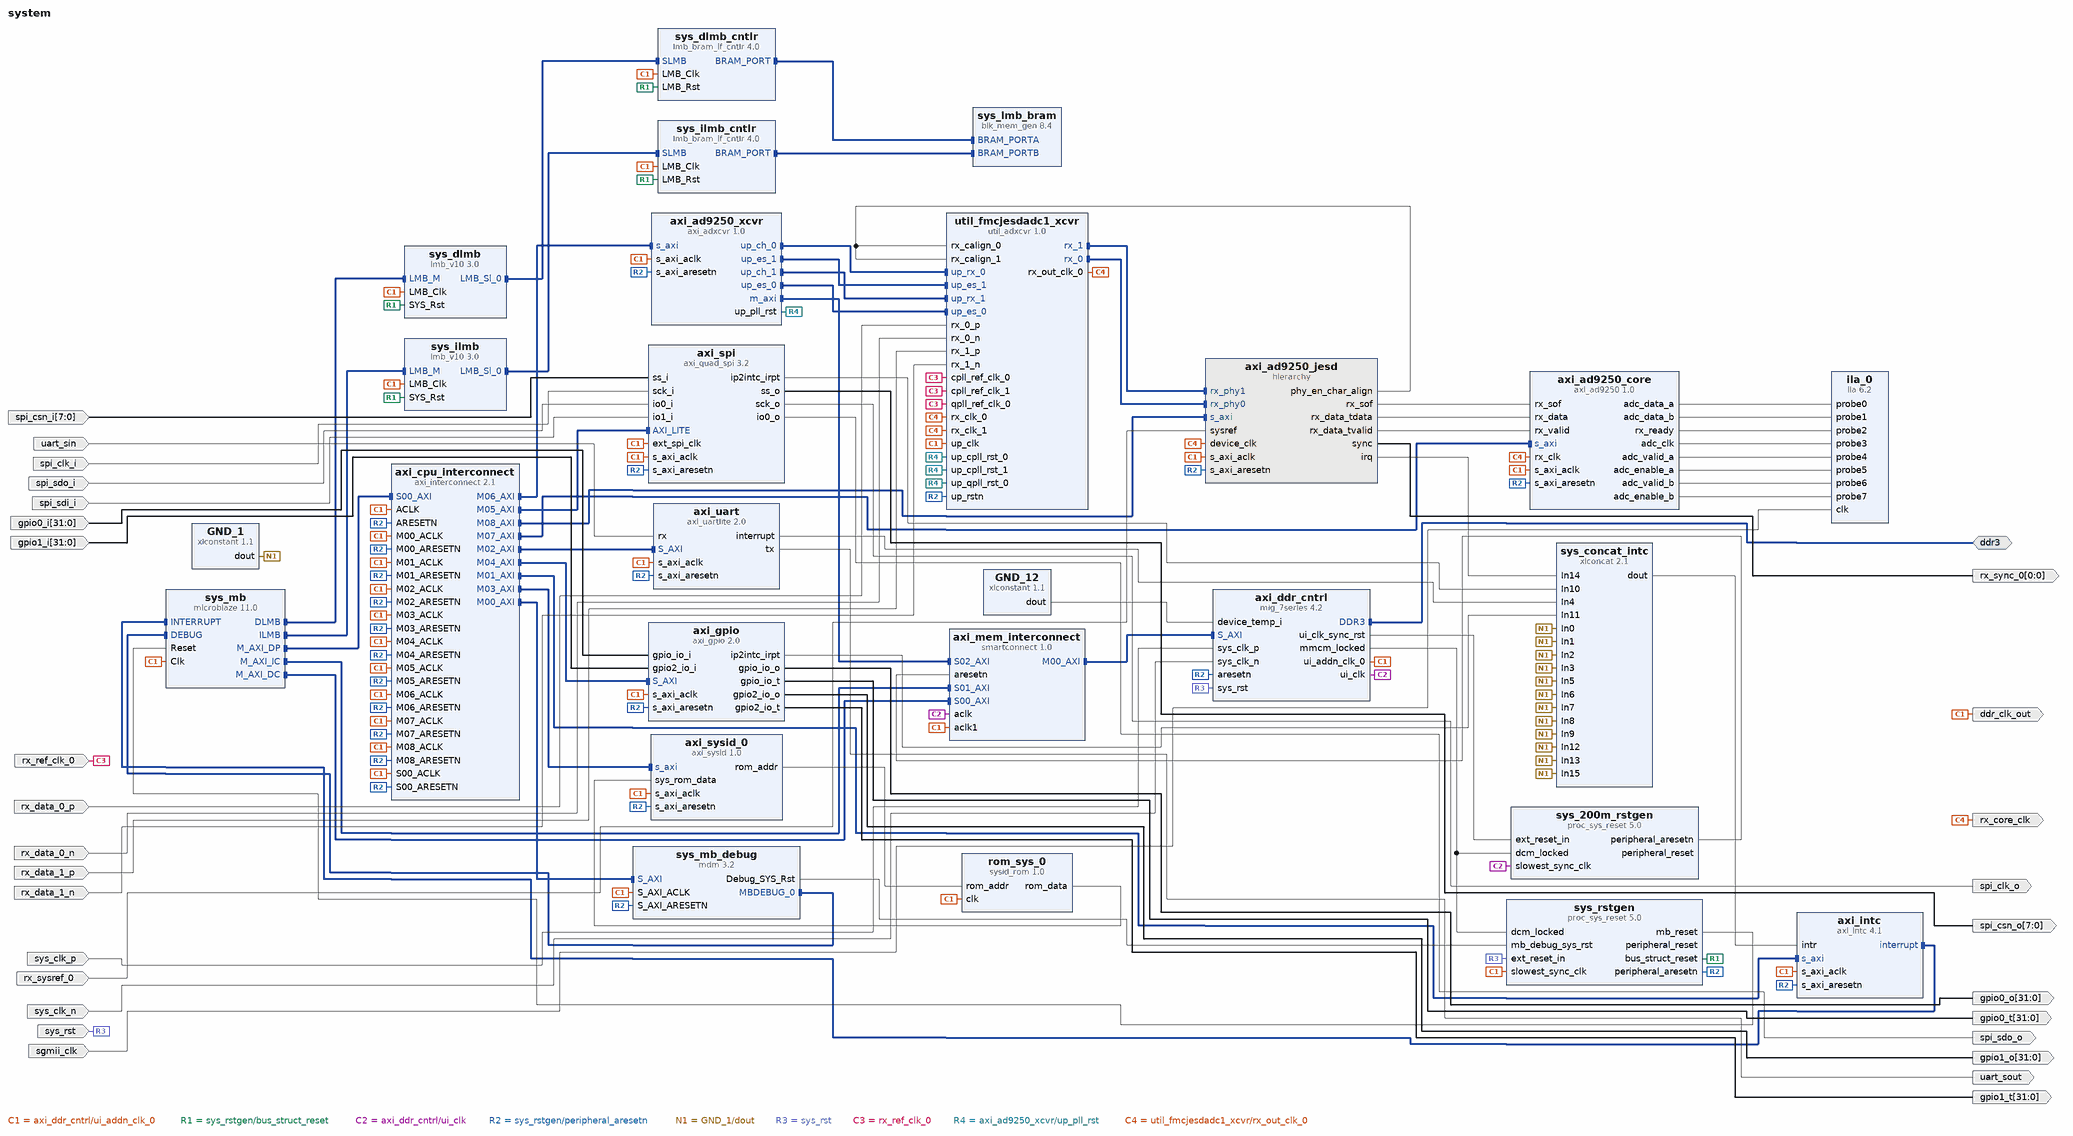
[diagram p0: block diagram of the top level]
# Vivado block design system, xc7k325tffg900-2, Vivado 2019.1
create_bd_design system

create_bd_intf_port -mode Master -vlnv xilinx.com:interface:ddrx_rtl:1.0 ddr3
create_bd_port -dir I -type rst sys_rst
set_property -dict {CONFIG.POLARITY ACTIVE_HIGH} [get_bd_ports sys_rst]
create_bd_port -dir I sys_clk_p
create_bd_port -dir I sys_clk_n
create_bd_port -dir I uart_sin
create_bd_port -dir O uart_sout
create_bd_port -dir O -from 7 -to 0 spi_csn_o
create_bd_port -dir I -from 7 -to 0 spi_csn_i
create_bd_port -dir I spi_clk_i
create_bd_port -dir O spi_clk_o
create_bd_port -dir I spi_sdo_i
create_bd_port -dir O spi_sdo_o
create_bd_port -dir I spi_sdi_i
create_bd_port -dir I -from 31 -to 0 gpio0_i
create_bd_port -dir O -from 31 -to 0 gpio0_o
create_bd_port -dir O -from 31 -to 0 gpio0_t
create_bd_port -dir I -from 31 -to 0 gpio1_i
create_bd_port -dir O -from 31 -to 0 gpio1_o
create_bd_port -dir O -from 31 -to 0 gpio1_t
create_bd_port -dir I rx_ref_clk_0
create_bd_port -dir O rx_core_clk
create_bd_port -dir I rx_sysref_0
create_bd_port -dir O -from 0 -to 0 rx_sync_0
create_bd_port -dir I rx_data_0_p
create_bd_port -dir I rx_data_0_n
create_bd_port -dir I rx_data_1_p
create_bd_port -dir I rx_data_1_n
create_bd_port -dir O -type clk ddr_clk_out
create_bd_port -dir I -type clk sgmii_clk
set_property -dict {CONFIG.FREQ_HZ 125000000} [get_bd_ports sgmii_clk]

create_bd_cell -type ip -vlnv xilinx.com:ip:microblaze:11.0 sys_mb
set_property -dict {CONFIG.G_TEMPLATE_LIST 4} [get_bd_cells sys_mb]
create_bd_cell -type ip -vlnv xilinx.com:ip:lmb_v10:3.0 sys_dlmb
create_bd_cell -type ip -vlnv xilinx.com:ip:lmb_v10:3.0 sys_ilmb
create_bd_cell -type ip -vlnv xilinx.com:ip:lmb_bram_if_cntlr:4.0 sys_dlmb_cntlr
set_property -dict {CONFIG.C_ECC 0} [get_bd_cells sys_dlmb_cntlr]
create_bd_cell -type ip -vlnv xilinx.com:ip:lmb_bram_if_cntlr:4.0 sys_ilmb_cntlr
set_property -dict {CONFIG.C_ECC 0} [get_bd_cells sys_ilmb_cntlr]
create_bd_cell -type ip -vlnv xilinx.com:ip:blk_mem_gen:8.4 sys_lmb_bram
set_property -dict {CONFIG.Memory_Type True_Dual_Port_RAM CONFIG.use_bram_block BRAM_Controller} [get_bd_cells sys_lmb_bram]
create_bd_cell -type ip -vlnv xilinx.com:ip:mdm:3.2 sys_mb_debug
set_property -dict {CONFIG.C_USE_UART 1} [get_bd_cells sys_mb_debug]
create_bd_cell -type ip -vlnv xilinx.com:ip:proc_sys_reset:5.0 sys_rstgen
set_property -dict {CONFIG.C_EXT_RST_WIDTH 1} [get_bd_cells sys_rstgen]
create_bd_cell -type ip -vlnv xilinx.com:ip:proc_sys_reset:5.0 sys_200m_rstgen
set_property -dict {CONFIG.C_EXT_RST_WIDTH 1} [get_bd_cells sys_200m_rstgen]
create_bd_cell -type ip -vlnv xilinx.com:ip:mig_7series:4.2 axi_ddr_cntrl
set_property -dict {CONFIG.XML_INPUT_FILE kc705_system_mig.prj} [get_bd_cells axi_ddr_cntrl]
create_bd_cell -type ip -vlnv xilinx.com:ip:axi_uartlite:2.0 axi_uart
set_property -dict {CONFIG.C_BAUDRATE 115200} [get_bd_cells axi_uart]
create_bd_cell -type ip -vlnv xilinx.com:ip:axi_quad_spi:3.2 axi_spi
set_property -dict {CONFIG.C_NUM_SS_BITS 8 CONFIG.C_SCK_RATIO 8 CONFIG.C_USE_STARTUP 0} [get_bd_cells axi_spi]
create_bd_cell -type ip -vlnv xilinx.com:ip:axi_gpio:2.0 axi_gpio
set_property -dict [list \
  CONFIG.C_GPIO2_WIDTH 32 \
  CONFIG.C_GPIO_WIDTH 32 \
  CONFIG.C_INTERRUPT_PRESENT 1 \
  CONFIG.C_IS_DUAL 1 \
] [get_bd_cells axi_gpio]
create_bd_cell -type ip -vlnv xilinx.com:ip:axi_intc:4.1 axi_intc
set_property -dict {CONFIG.C_HAS_FAST 0 CONFIG.C_KIND_OF_INTR 0xFFFFFFFF} [get_bd_cells axi_intc]
create_bd_cell -type ip -vlnv xilinx.com:ip:xlconcat:2.1 sys_concat_intc
set_property -dict {CONFIG.NUM_PORTS 16} [get_bd_cells sys_concat_intc]
create_bd_cell -type ip -vlnv analog.com:user:axi_sysid:1.0 axi_sysid_0
set_property -dict {CONFIG.ROM_ADDR_BITS 9} [get_bd_cells axi_sysid_0]
create_bd_cell -type ip -vlnv analog.com:user:sysid_rom:1.0 rom_sys_0
set_property -dict [list \
  CONFIG.PATH_TO_FILE d:/adi_minimal/hdl/projects/fmcjesdadc1/kc705/mem_init_sys.txt \
  CONFIG.ROM_ADDR_BITS 9 \
] [get_bd_cells rom_sys_0]
create_bd_cell -type ip -vlnv xilinx.com:ip:xlconstant:1.1 GND_1
set_property -dict {CONFIG.CONST_VAL 0 CONFIG.CONST_WIDTH 1} [get_bd_cells GND_1]
create_bd_cell -type ip -vlnv xilinx.com:ip:axi_interconnect:2.1 axi_cpu_interconnect
set_property -dict {CONFIG.NUM_MI 9} [get_bd_cells axi_cpu_interconnect]
create_bd_cell -type ip -vlnv xilinx.com:ip:smartconnect:1.0 axi_mem_interconnect
set_property -dict {CONFIG.NUM_CLKS 2 CONFIG.NUM_MI 1 CONFIG.NUM_SI 3} [get_bd_cells axi_mem_interconnect]
create_bd_cell -type ip -vlnv xilinx.com:ip:xlconstant:1.1 GND_12
set_property -dict {CONFIG.CONST_VAL 0 CONFIG.CONST_WIDTH 12} [get_bd_cells GND_12]
create_bd_cell -type ip -vlnv analog.com:user:axi_adxcvr:1.0 axi_ad9250_xcvr
set_property -dict [list \
  CONFIG.LPM_OR_DFE_N 0 \
  CONFIG.NUM_OF_LANES 2 \
  CONFIG.OUT_CLK_SEL 0x2 \
  CONFIG.QPLL_ENABLE 0 \
  CONFIG.SYS_CLK_SEL 0x0 \
  CONFIG.TX_OR_RX_N 0 \
] [get_bd_cells axi_ad9250_xcvr]
create_bd_cell -type hier axi_ad9250_jesd
create_bd_cell -type ip -vlnv analog.com:user:axi_ad9250:1.0 axi_ad9250_core
create_bd_cell -type ip -vlnv analog.com:user:util_adxcvr:1.0 util_fmcjesdadc1_xcvr
set_property -dict [list \
  CONFIG.CPLL_FBDIV 2 \
  CONFIG.QPLL_FBDIV 0x080 \
  CONFIG.RX_CDR_CFG 0x03000023ff10200020 \
  CONFIG.RX_CLK25_DIV 10 \
  CONFIG.RX_DFE_LPM_CFG 0x0904 \
  CONFIG.RX_NUM_OF_LANES 2 \
  CONFIG.RX_OUT_DIV 1 \
  CONFIG.RX_PMA_CFG 0x00018480 \
  CONFIG.TX_CLK25_DIV 10 \
  CONFIG.TX_NUM_OF_LANES 0 \
  CONFIG.TX_OUT_DIV 1 \
] [get_bd_cells util_fmcjesdadc1_xcvr]
create_bd_cell -type ip -vlnv xilinx.com:ip:ila:6.2 ila_0
set_property -dict [list \
  CONFIG.ALL_PROBE_SAME_MU_CNT 2 \
  CONFIG.C_ADV_TRIGGER true \
  CONFIG.C_DATA_DEPTH 4096 \
  CONFIG.C_ENABLE_ILA_AXI_MON false \
  CONFIG.C_EN_STRG_QUAL 1 \
  CONFIG.C_MONITOR_TYPE Native \
  CONFIG.C_NUM_OF_PROBES 8 \
  CONFIG.C_PROBE0_MU_CNT 2 \
  CONFIG.C_PROBE0_WIDTH 32 \
  CONFIG.C_PROBE10_MU_CNT 2 \
  CONFIG.C_PROBE10_TYPE 0 \
  CONFIG.C_PROBE10_WIDTH 1 \
  CONFIG.C_PROBE11_MU_CNT 2 \
  CONFIG.C_PROBE12_MU_CNT 2 \
  CONFIG.C_PROBE12_TYPE 1 \
  CONFIG.C_PROBE12_WIDTH 1 \
  CONFIG.C_PROBE13_MU_CNT 2 \
  CONFIG.C_PROBE13_TYPE 1 \
  CONFIG.C_PROBE13_WIDTH 1 \
  CONFIG.C_PROBE1_MU_CNT 2 \
  CONFIG.C_PROBE1_TYPE 1 \
  CONFIG.C_PROBE1_WIDTH 32 \
  CONFIG.C_PROBE2_MU_CNT 2 \
  CONFIG.C_PROBE2_WIDTH 1 \
  CONFIG.C_PROBE3_MU_CNT 2 \
  CONFIG.C_PROBE4_MU_CNT 2 \
  CONFIG.C_PROBE4_TYPE 1 \
  CONFIG.C_PROBE4_WIDTH 1 \
  CONFIG.C_PROBE5_MU_CNT 2 \
  CONFIG.C_PROBE5_TYPE 1 \
  CONFIG.C_PROBE5_WIDTH 1 \
  CONFIG.C_PROBE6_MU_CNT 2 \
  CONFIG.C_PROBE7_MU_CNT 2 \
  CONFIG.C_PROBE8_MU_CNT 2 \
  CONFIG.C_PROBE8_WIDTH 1 \
  CONFIG.C_PROBE9_MU_CNT 2 \
  CONFIG.C_PROBE9_WIDTH 1 \
] [get_bd_cells ila_0]

# ---- hierarchy /axi_ad9250_jesd ----
current_bd_instance /axi_ad9250_jesd
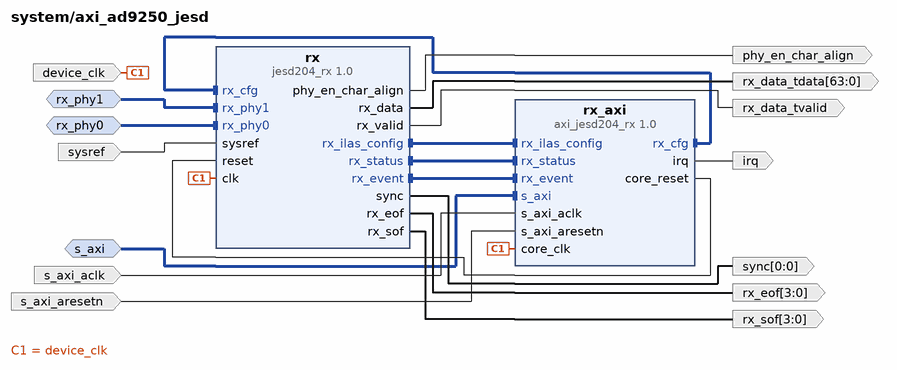
[diagram p1: block diagram inside /axi_ad9250_jesd]
create_bd_intf_pin -mode Slave -vlnv xilinx.com:interface:aximm_rtl:1.0 s_axi
create_bd_intf_pin -mode Slave -vlnv xilinx.com:display_jesd204:jesd204_rx_bus_rtl:1.0 rx_phy0
create_bd_intf_pin -mode Slave -vlnv xilinx.com:display_jesd204:jesd204_rx_bus_rtl:1.0 rx_phy1
create_bd_pin -dir I -type clk s_axi_aclk
create_bd_pin -dir I -type rst s_axi_aresetn
create_bd_pin -dir O -type intr irq
create_bd_pin -dir I -type clk device_clk
create_bd_pin -dir O -from 0 -to 0 sync
create_bd_pin -dir I sysref
create_bd_pin -dir O phy_en_char_align
create_bd_pin -dir O -from 3 -to 0 rx_eof
create_bd_pin -dir O -from 3 -to 0 rx_sof
create_bd_pin -dir O rx_data_tvalid
create_bd_pin -dir O -from 63 -to 0 rx_data_tdata

create_bd_cell -type ip -vlnv analog.com:user:axi_jesd204_rx:1.0 rx_axi
set_property -dict {CONFIG.LINK_MODE 1 CONFIG.NUM_LANES 2 CONFIG.NUM_LINKS 1} [get_bd_cells rx_axi]
create_bd_cell -type ip -vlnv analog.com:user:jesd204_rx:1.0 rx
set_property -dict {CONFIG.LINK_MODE 1 CONFIG.NUM_LANES 2 CONFIG.NUM_LINKS 1} [get_bd_cells rx]

# ---- connections ----

current_bd_instance /axi_ad9250_jesd
connect_bd_intf_net [get_bd_intf_pins rx/rx_ilas_config] [get_bd_intf_pins rx_axi/rx_ilas_config]
connect_bd_intf_net [get_bd_intf_pins rx/rx_status] [get_bd_intf_pins rx_axi/rx_status]
connect_bd_intf_net [get_bd_intf_pins rx/rx_event] [get_bd_intf_pins rx_axi/rx_event]
connect_bd_intf_net -intf_net rx_phy1_1 [get_bd_intf_pins rx_phy1] [get_bd_intf_pins rx/rx_phy1]
connect_bd_intf_net -intf_net rx_phy0_1 [get_bd_intf_pins rx_phy0] [get_bd_intf_pins rx/rx_phy0]
connect_bd_intf_net [get_bd_intf_pins rx_axi/rx_cfg] [get_bd_intf_pins rx/rx_cfg]
connect_bd_intf_net [get_bd_intf_pins s_axi] [get_bd_intf_pins rx_axi/s_axi]
connect_bd_net [get_bd_pins rx_axi/core_reset] [get_bd_pins rx/reset]
connect_bd_net [get_bd_pins s_axi_aclk] [get_bd_pins rx_axi/s_axi_aclk]
connect_bd_net [get_bd_pins s_axi_aresetn] [get_bd_pins rx_axi/s_axi_aresetn]
connect_bd_net [get_bd_pins rx_axi/irq] [get_bd_pins irq]
connect_bd_net [get_bd_pins device_clk] [get_bd_pins rx_axi/core_clk] [get_bd_pins rx/clk]
connect_bd_net [get_bd_pins rx/sync] [get_bd_pins sync]
connect_bd_net [get_bd_pins sysref] [get_bd_pins rx/sysref]
connect_bd_net [get_bd_pins rx/phy_en_char_align] [get_bd_pins phy_en_char_align]
connect_bd_net [get_bd_pins rx/rx_data] [get_bd_pins rx_data_tdata]
connect_bd_net [get_bd_pins rx/rx_valid] [get_bd_pins rx_data_tvalid]
connect_bd_net [get_bd_pins rx/rx_eof] [get_bd_pins rx_eof]
connect_bd_net [get_bd_pins rx/rx_sof] [get_bd_pins rx_sof]

current_bd_instance /
connect_bd_intf_net [get_bd_intf_pins axi_intc/interrupt] [get_bd_intf_pins sys_mb/INTERRUPT]
connect_bd_intf_net [get_bd_intf_pins axi_cpu_interconnect/M04_AXI] [get_bd_intf_pins axi_gpio/S_AXI]
connect_bd_intf_net [get_bd_intf_pins axi_cpu_interconnect/M03_AXI] [get_bd_intf_pins axi_sysid_0/s_axi]
connect_bd_intf_net [get_bd_intf_pins sys_mb/DLMB] [get_bd_intf_pins sys_dlmb/LMB_M]
connect_bd_intf_net [get_bd_intf_pins axi_cpu_interconnect/M05_AXI] [get_bd_intf_pins axi_spi/AXI_LITE]
connect_bd_intf_net [get_bd_intf_pins axi_cpu_interconnect/M01_AXI] [get_bd_intf_pins axi_intc/s_axi]
connect_bd_intf_net [get_bd_intf_pins axi_ad9250_xcvr/up_ch_0] [get_bd_intf_pins util_fmcjesdadc1_xcvr/up_rx_0]
connect_bd_intf_net [get_bd_intf_pins axi_cpu_interconnect/M02_AXI] [get_bd_intf_pins axi_uart/S_AXI]
connect_bd_intf_net [get_bd_intf_pins axi_cpu_interconnect/M06_AXI] [get_bd_intf_pins axi_ad9250_xcvr/s_axi]
connect_bd_intf_net [get_bd_intf_pins sys_ilmb/LMB_Sl_0] [get_bd_intf_pins sys_ilmb_cntlr/SLMB]
connect_bd_intf_net [get_bd_intf_pins sys_dlmb/LMB_Sl_0] [get_bd_intf_pins sys_dlmb_cntlr/SLMB]
connect_bd_intf_net [get_bd_intf_pins axi_ad9250_xcvr/up_es_1] [get_bd_intf_pins util_fmcjesdadc1_xcvr/up_es_1]
connect_bd_intf_net [get_bd_intf_pins axi_mem_interconnect/S01_AXI] [get_bd_intf_pins sys_mb/M_AXI_IC]
connect_bd_intf_net [get_bd_intf_pins axi_cpu_interconnect/M00_AXI] [get_bd_intf_pins sys_mb_debug/S_AXI]
connect_bd_intf_net [get_bd_intf_pins axi_ad9250_xcvr/up_ch_1] [get_bd_intf_pins util_fmcjesdadc1_xcvr/up_rx_1]
connect_bd_intf_net [get_bd_intf_pins axi_cpu_interconnect/M07_AXI] [get_bd_intf_pins axi_ad9250_core/s_axi]
connect_bd_intf_net [get_bd_intf_pins util_fmcjesdadc1_xcvr/rx_1] [get_bd_intf_pins axi_ad9250_jesd/rx_phy1]
connect_bd_intf_net [get_bd_intf_pins axi_cpu_interconnect/M08_AXI] [get_bd_intf_pins axi_ad9250_jesd/s_axi]
connect_bd_intf_net [get_bd_intf_pins util_fmcjesdadc1_xcvr/rx_0] [get_bd_intf_pins axi_ad9250_jesd/rx_phy0]
connect_bd_intf_net [get_bd_intf_pins sys_ilmb_cntlr/BRAM_PORT] [get_bd_intf_pins sys_lmb_bram/BRAM_PORTB]
connect_bd_intf_net [get_bd_intf_pins sys_mb_debug/MBDEBUG_0] [get_bd_intf_pins sys_mb/DEBUG]
connect_bd_intf_net [get_bd_intf_pins axi_mem_interconnect/S02_AXI] [get_bd_intf_pins axi_ad9250_xcvr/m_axi]
connect_bd_intf_net [get_bd_intf_pins axi_cpu_interconnect/S00_AXI] [get_bd_intf_pins sys_mb/M_AXI_DP]
connect_bd_intf_net [get_bd_intf_pins sys_dlmb_cntlr/BRAM_PORT] [get_bd_intf_pins sys_lmb_bram/BRAM_PORTA]
connect_bd_intf_net [get_bd_intf_pins sys_mb/ILMB] [get_bd_intf_pins sys_ilmb/LMB_M]
connect_bd_intf_net [get_bd_intf_pins axi_mem_interconnect/M00_AXI] [get_bd_intf_pins axi_ddr_cntrl/S_AXI]
connect_bd_intf_net [get_bd_intf_pins axi_ad9250_xcvr/up_es_0] [get_bd_intf_pins util_fmcjesdadc1_xcvr/up_es_0]
connect_bd_intf_net [get_bd_intf_ports ddr3] [get_bd_intf_pins axi_ddr_cntrl/DDR3]
connect_bd_intf_net [get_bd_intf_pins axi_mem_interconnect/S00_AXI] [get_bd_intf_pins sys_mb/M_AXI_DC]
connect_bd_net [get_bd_pins axi_sysid_0/rom_addr] [get_bd_pins rom_sys_0/rom_addr]
connect_bd_net [get_bd_pins rom_sys_0/rom_data] [get_bd_pins axi_sysid_0/sys_rom_data]
connect_bd_net -net sys_cpu_clk [get_bd_pins axi_ddr_cntrl/ui_addn_clk_0] \
  [get_bd_pins rom_sys_0/clk] [get_bd_pins sys_rstgen/slowest_sync_clk] [get_bd_pins sys_mb/Clk] \
  [get_bd_pins sys_dlmb/LMB_Clk] [get_bd_pins sys_ilmb/LMB_Clk] [get_bd_pins sys_dlmb_cntlr/LMB_Clk] \
  [get_bd_pins sys_ilmb_cntlr/LMB_Clk] [get_bd_pins axi_spi/ext_spi_clk] [get_bd_pins axi_cpu_interconnect/ACLK] \
  [get_bd_pins axi_cpu_interconnect/S00_ACLK] [get_bd_pins axi_cpu_interconnect/M00_ACLK] \
  [get_bd_pins sys_mb_debug/S_AXI_ACLK] [get_bd_pins axi_cpu_interconnect/M01_ACLK] [get_bd_pins axi_intc/s_axi_aclk] \
  [get_bd_pins axi_cpu_interconnect/M02_ACLK] [get_bd_pins axi_uart/s_axi_aclk] [get_bd_pins axi_cpu_interconnect/M03_ACLK] \
  [get_bd_pins axi_sysid_0/s_axi_aclk] [get_bd_pins axi_cpu_interconnect/M04_ACLK] [get_bd_pins axi_gpio/s_axi_aclk] \
  [get_bd_pins axi_cpu_interconnect/M05_ACLK] [get_bd_pins axi_spi/s_axi_aclk] [get_bd_pins axi_mem_interconnect/aclk1] \
  [get_bd_pins util_fmcjesdadc1_xcvr/up_clk] [get_bd_pins axi_cpu_interconnect/M06_ACLK] \
  [get_bd_pins axi_ad9250_xcvr/s_axi_aclk] [get_bd_pins axi_cpu_interconnect/M07_ACLK] \
  [get_bd_pins axi_ad9250_core/s_axi_aclk] [get_bd_pins axi_cpu_interconnect/M08_ACLK] \
  [get_bd_pins axi_ad9250_jesd/s_axi_aclk] [get_bd_ports ddr_clk_out]
connect_bd_net [get_bd_pins sys_mb_debug/Debug_SYS_Rst] [get_bd_pins sys_rstgen/mb_debug_sys_rst]
connect_bd_net [get_bd_pins sys_rstgen/mb_reset] [get_bd_pins sys_mb/Reset]
connect_bd_net [get_bd_pins sys_rstgen/bus_struct_reset] \
  [get_bd_pins sys_dlmb/SYS_Rst] [get_bd_pins sys_ilmb/SYS_Rst] [get_bd_pins sys_dlmb_cntlr/LMB_Rst] \
  [get_bd_pins sys_ilmb_cntlr/LMB_Rst]
connect_bd_net [get_bd_pins sys_concat_intc/dout] [get_bd_pins axi_intc/intr]
connect_bd_net [get_bd_pins axi_ddr_cntrl/mmcm_locked] [get_bd_pins sys_rstgen/dcm_locked] [get_bd_pins sys_200m_rstgen/dcm_locked]
connect_bd_net -net sys_200m_clk [get_bd_pins axi_ddr_cntrl/ui_clk] \
  [get_bd_pins sys_200m_rstgen/slowest_sync_clk] [get_bd_pins axi_mem_interconnect/aclk]
connect_bd_net -net sys_cpu_resetn [get_bd_pins sys_rstgen/peripheral_aresetn] \
  [get_bd_pins axi_ddr_cntrl/aresetn] [get_bd_pins axi_cpu_interconnect/ARESETN] \
  [get_bd_pins axi_cpu_interconnect/S00_ARESETN] [get_bd_pins axi_cpu_interconnect/M00_ARESETN] \
  [get_bd_pins sys_mb_debug/S_AXI_ARESETN] [get_bd_pins axi_cpu_interconnect/M01_ARESETN] \
  [get_bd_pins axi_intc/s_axi_aresetn] [get_bd_pins axi_cpu_interconnect/M02_ARESETN] [get_bd_pins axi_uart/s_axi_aresetn] \
  [get_bd_pins axi_cpu_interconnect/M03_ARESETN] [get_bd_pins axi_sysid_0/s_axi_aresetn] \
  [get_bd_pins axi_cpu_interconnect/M04_ARESETN] [get_bd_pins axi_gpio/s_axi_aresetn] \
  [get_bd_pins axi_cpu_interconnect/M05_ARESETN] [get_bd_pins axi_spi/s_axi_aresetn] \
  [get_bd_pins util_fmcjesdadc1_xcvr/up_rstn] [get_bd_pins axi_cpu_interconnect/M06_ARESETN] \
  [get_bd_pins axi_ad9250_xcvr/s_axi_aresetn] [get_bd_pins axi_cpu_interconnect/M07_ARESETN] \
  [get_bd_pins axi_ad9250_core/s_axi_aresetn] [get_bd_pins axi_cpu_interconnect/M08_ARESETN] \
  [get_bd_pins axi_ad9250_jesd/s_axi_aresetn]
# net sys_cpu_reset has one end: sys_rstgen/peripheral_reset
# net sys_200m_reset has one end: sys_200m_rstgen/peripheral_reset
connect_bd_net -net sys_200m_resetn [get_bd_pins sys_200m_rstgen/peripheral_aresetn] [get_bd_pins axi_mem_interconnect/aresetn]
connect_bd_net [get_bd_pins GND_1/dout] \
  [get_bd_pins sys_concat_intc/In0] [get_bd_pins sys_concat_intc/In1] [get_bd_pins sys_concat_intc/In2] \
  [get_bd_pins sys_concat_intc/In3] [get_bd_pins sys_concat_intc/In5] [get_bd_pins sys_concat_intc/In6] \
  [get_bd_pins sys_concat_intc/In7] [get_bd_pins sys_concat_intc/In8] [get_bd_pins sys_concat_intc/In9] \
  [get_bd_pins sys_concat_intc/In13] [get_bd_pins sys_concat_intc/In15] [get_bd_pins sys_concat_intc/In12]
connect_bd_net [get_bd_pins axi_uart/interrupt] [get_bd_pins sys_concat_intc/In4]
connect_bd_net [get_bd_pins axi_spi/ip2intc_irpt] [get_bd_pins sys_concat_intc/In10]
connect_bd_net [get_bd_pins axi_gpio/ip2intc_irpt] [get_bd_pins sys_concat_intc/In11]
connect_bd_net [get_bd_ports sys_rst] [get_bd_pins sys_rstgen/ext_reset_in] [get_bd_pins axi_ddr_cntrl/sys_rst]
connect_bd_net -net sys_200m_rst [get_bd_pins axi_ddr_cntrl/ui_clk_sync_rst] [get_bd_pins sys_200m_rstgen/ext_reset_in]
connect_bd_net [get_bd_ports sys_clk_p] [get_bd_pins axi_ddr_cntrl/sys_clk_p]
connect_bd_net [get_bd_ports sys_clk_n] [get_bd_pins axi_ddr_cntrl/sys_clk_n]
connect_bd_net [get_bd_ports uart_sin] [get_bd_pins axi_uart/rx]
connect_bd_net [get_bd_pins axi_uart/tx] [get_bd_ports uart_sout]
connect_bd_net [get_bd_ports spi_csn_i] [get_bd_pins axi_spi/ss_i]
connect_bd_net [get_bd_pins axi_spi/ss_o] [get_bd_ports spi_csn_o]
connect_bd_net [get_bd_ports spi_clk_i] [get_bd_pins axi_spi/sck_i]
connect_bd_net [get_bd_pins axi_spi/sck_o] [get_bd_ports spi_clk_o]
connect_bd_net [get_bd_ports spi_sdo_i] [get_bd_pins axi_spi/io0_i]
connect_bd_net [get_bd_pins axi_spi/io0_o] [get_bd_ports spi_sdo_o]
connect_bd_net [get_bd_ports spi_sdi_i] [get_bd_pins axi_spi/io1_i]
connect_bd_net [get_bd_ports gpio0_i] [get_bd_pins axi_gpio/gpio_io_i]
connect_bd_net [get_bd_pins axi_gpio/gpio_io_o] [get_bd_ports gpio0_o]
connect_bd_net [get_bd_pins axi_gpio/gpio_io_t] [get_bd_ports gpio0_t]
connect_bd_net [get_bd_ports gpio1_i] [get_bd_pins axi_gpio/gpio2_io_i]
connect_bd_net [get_bd_pins axi_gpio/gpio2_io_o] [get_bd_ports gpio1_o]
connect_bd_net [get_bd_pins axi_gpio/gpio2_io_t] [get_bd_ports gpio1_t]
connect_bd_net [get_bd_pins GND_12/dout] [get_bd_pins axi_ddr_cntrl/device_temp_i]
connect_bd_net -net rx_ref_clk_0_1 [get_bd_ports rx_ref_clk_0] \
  [get_bd_pins util_fmcjesdadc1_xcvr/qpll_ref_clk_0] [get_bd_pins util_fmcjesdadc1_xcvr/cpll_ref_clk_0] \
  [get_bd_pins util_fmcjesdadc1_xcvr/cpll_ref_clk_1]
connect_bd_net [get_bd_pins axi_ad9250_xcvr/up_pll_rst] \
  [get_bd_pins util_fmcjesdadc1_xcvr/up_qpll_rst_0] [get_bd_pins util_fmcjesdadc1_xcvr/up_cpll_rst_0] \
  [get_bd_pins util_fmcjesdadc1_xcvr/up_cpll_rst_1]
connect_bd_net [get_bd_pins util_fmcjesdadc1_xcvr/rx_out_clk_0] \
  [get_bd_pins util_fmcjesdadc1_xcvr/rx_clk_0] [get_bd_pins util_fmcjesdadc1_xcvr/rx_clk_1] \
  [get_bd_pins axi_ad9250_jesd/device_clk] [get_bd_ports rx_core_clk] [get_bd_pins axi_ad9250_core/rx_clk]
connect_bd_net [get_bd_pins axi_ad9250_jesd/phy_en_char_align] \
  [get_bd_pins util_fmcjesdadc1_xcvr/rx_calign_0] [get_bd_pins util_fmcjesdadc1_xcvr/rx_calign_1]
connect_bd_net [get_bd_ports rx_data_0_p] [get_bd_pins util_fmcjesdadc1_xcvr/rx_0_p]
connect_bd_net [get_bd_ports rx_data_0_n] [get_bd_pins util_fmcjesdadc1_xcvr/rx_0_n]
connect_bd_net [get_bd_ports rx_data_1_p] [get_bd_pins util_fmcjesdadc1_xcvr/rx_1_p]
connect_bd_net [get_bd_ports rx_data_1_n] [get_bd_pins util_fmcjesdadc1_xcvr/rx_1_n]
connect_bd_net -net sysref_1 [get_bd_ports rx_sysref_0] [get_bd_pins axi_ad9250_jesd/sysref]
connect_bd_net [get_bd_pins axi_ad9250_jesd/sync] [get_bd_ports rx_sync_0]
connect_bd_net [get_bd_pins axi_ad9250_jesd/rx_sof] [get_bd_pins axi_ad9250_core/rx_sof]
connect_bd_net [get_bd_pins axi_ad9250_jesd/irq] [get_bd_pins sys_concat_intc/In14]
connect_bd_net [get_bd_pins axi_ad9250_jesd/rx_data_tdata] [get_bd_pins axi_ad9250_core/rx_data]
connect_bd_net [get_bd_pins axi_ad9250_jesd/rx_data_tvalid] [get_bd_pins axi_ad9250_core/rx_valid]
connect_bd_net [get_bd_pins axi_ad9250_core/adc_data_a] [get_bd_pins ila_0/probe0]
connect_bd_net [get_bd_pins axi_ad9250_core/adc_data_b] [get_bd_pins ila_0/probe1]
connect_bd_net [get_bd_pins axi_ad9250_core/rx_ready] [get_bd_pins ila_0/probe2]
connect_bd_net [get_bd_pins axi_ad9250_core/adc_clk] [get_bd_pins ila_0/probe3]
connect_bd_net [get_bd_pins axi_ad9250_core/adc_valid_a] [get_bd_pins ila_0/probe4]
connect_bd_net [get_bd_pins axi_ad9250_core/adc_enable_a] [get_bd_pins ila_0/probe5]
connect_bd_net [get_bd_pins axi_ad9250_core/adc_valid_b] [get_bd_pins ila_0/probe6]
connect_bd_net [get_bd_pins axi_ad9250_core/adc_enable_b] [get_bd_pins ila_0/probe7]
connect_bd_net [get_bd_ports sgmii_clk] [get_bd_pins ila_0/clk]
set_property HDL_ATTRIBUTE.BMM_INFO_PROCESSOR {microblaze-le > system sys_dlmb_cntlr} [get_bd_cells sys_mb]
set_property HDL_ATTRIBUTE.KEEP_HIERARCHY yes [get_bd_cells sys_mb]
set_property HDL_ATTRIBUTE.BMM_INFO_ADDRESS_SPACE {byte  0x00000000 32 > system sys_lmb_bram} [get_bd_cells sys_dlmb_cntlr]
set_property HDL_ATTRIBUTE.KEEP_HIERARCHY yes [get_bd_cells sys_dlmb_cntlr]

# ---- address map ----
assign_bd_address -offset 0x80000000 -range 1G -target_address_space [get_bd_addr_spaces axi_ad9250_xcvr/m_axi] [get_bd_addr_segs axi_ddr_cntrl/memmap/memaddr]
assign_bd_address -offset 0x00000000 -range 128K -target_address_space [get_bd_addr_spaces sys_mb/Data] [get_bd_addr_segs sys_dlmb_cntlr/SLMB/Mem]
assign_bd_address -offset 0x40000000 -range 4K -target_address_space [get_bd_addr_spaces sys_mb/Data] [get_bd_addr_segs axi_gpio/S_AXI/Reg]
assign_bd_address -offset 0x40600000 -range 4K -target_address_space [get_bd_addr_spaces sys_mb/Data] [get_bd_addr_segs axi_uart/S_AXI/Reg]
assign_bd_address -offset 0x41200000 -range 4K -target_address_space [get_bd_addr_spaces sys_mb/Data] [get_bd_addr_segs axi_intc/S_AXI/Reg]
assign_bd_address -offset 0x41400000 -range 4K -target_address_space [get_bd_addr_spaces sys_mb/Data] [get_bd_addr_segs sys_mb_debug/S_AXI/Reg]
assign_bd_address -offset 0x44A10000 -range 4K -target_address_space [get_bd_addr_spaces sys_mb/Data] [get_bd_addr_segs axi_ad9250_core/s_axi/axi_lite]
assign_bd_address -offset 0x44A60000 -range 64K -target_address_space [get_bd_addr_spaces sys_mb/Data] [get_bd_addr_segs axi_ad9250_xcvr/s_axi/axi_lite]
assign_bd_address -offset 0x44A70000 -range 4K -target_address_space [get_bd_addr_spaces sys_mb/Data] [get_bd_addr_segs axi_spi/AXI_LITE/Reg]
assign_bd_address -offset 0x44AA0000 -range 16K -target_address_space [get_bd_addr_spaces sys_mb/Data] [get_bd_addr_segs axi_ad9250_jesd/rx_axi/s_axi/axi_lite]
assign_bd_address -offset 0x45000000 -range 64K -target_address_space [get_bd_addr_spaces sys_mb/Data] [get_bd_addr_segs axi_sysid_0/s_axi/axi_lite]
assign_bd_address -offset 0x80000000 -range 1G -target_address_space [get_bd_addr_spaces sys_mb/Data] [get_bd_addr_segs axi_ddr_cntrl/memmap/memaddr]
assign_bd_address -offset 0x00000000 -range 128K -target_address_space [get_bd_addr_spaces sys_mb/Instruction] [get_bd_addr_segs sys_ilmb_cntlr/SLMB/Mem]
assign_bd_address -offset 0x80000000 -range 1G -target_address_space [get_bd_addr_spaces sys_mb/Instruction] [get_bd_addr_segs axi_ddr_cntrl/memmap/memaddr]

validate_bd_design
save_bd_design
